# EAGLE schematic DAQ2 (EAGLE 7.6.0)
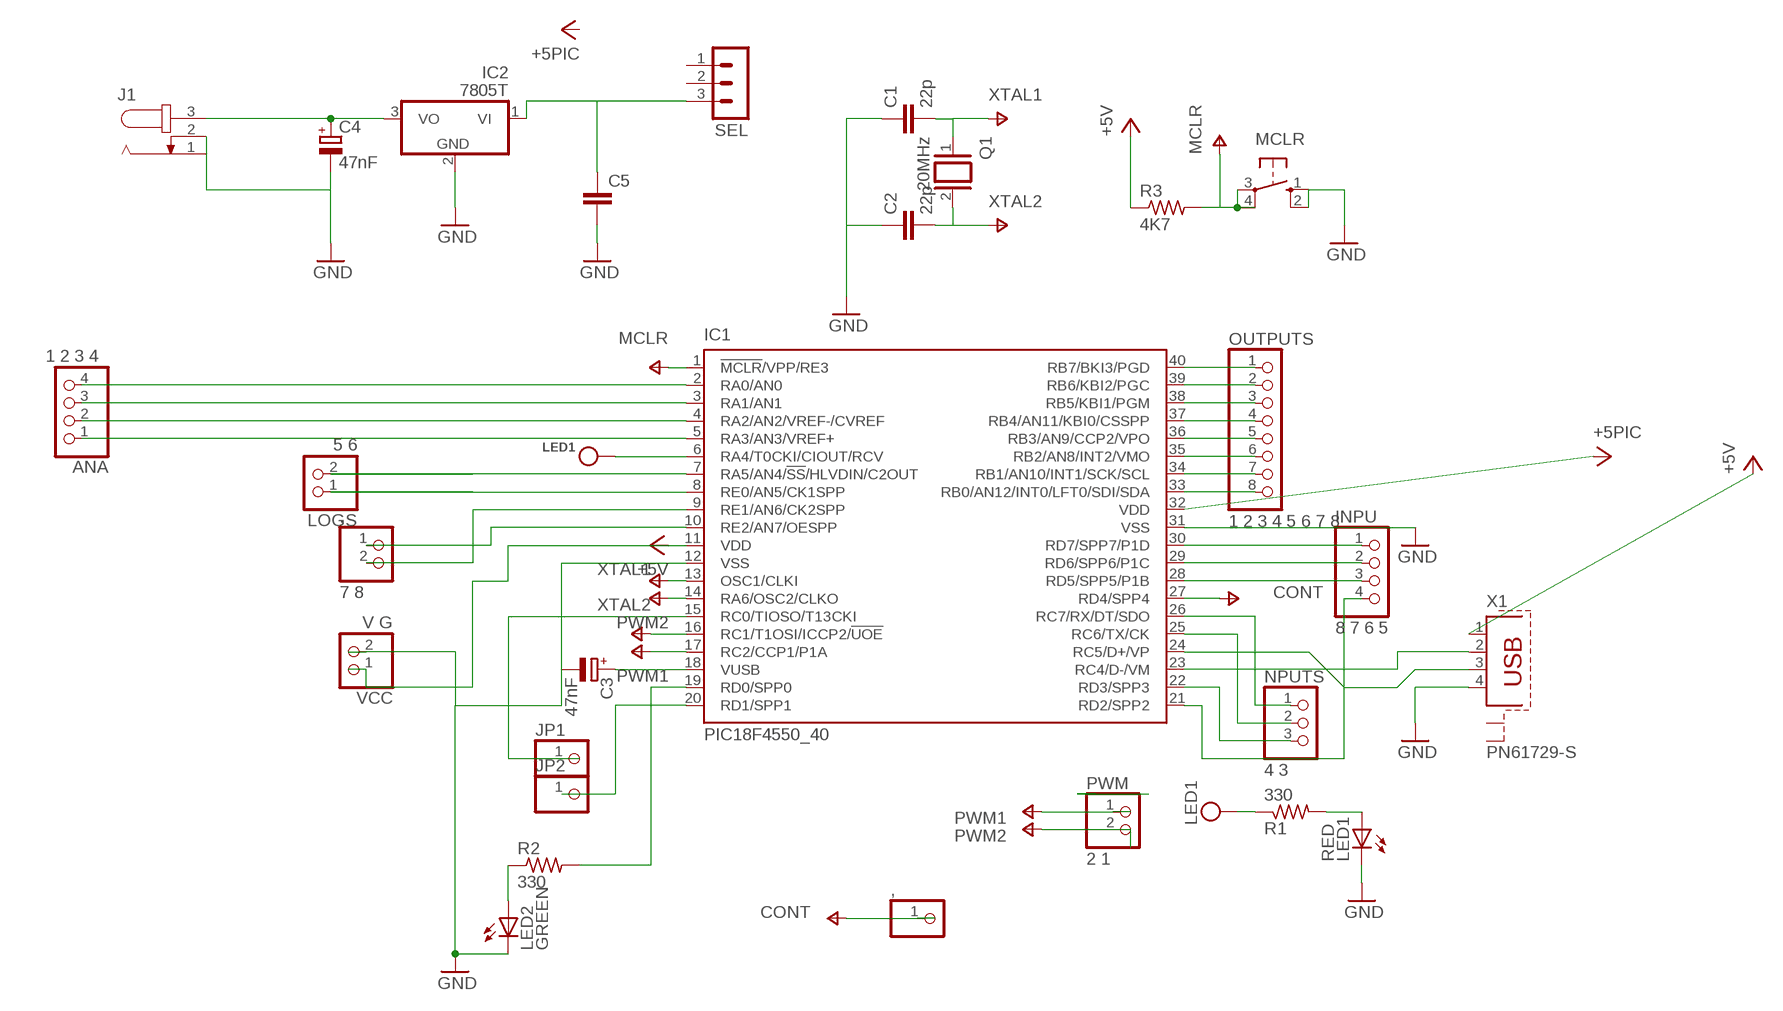
[diagram p0: schematic, sheet 1]

## Parts
,  PINHD-1X1  [1X01]
.  7 8  PINHD-1X2  [1X02]
ANA  1 2 3 4  PINHD-1X4  [1X04]
C1  22p  C-EU025-024X044  [C025-024X044]
C2  22p  C-EU025-024X044  [C025-024X044]
C3  47nF  CPOL-EUE2,5-6E  [E2,5-6E]
C4  47nF  CPOL-EUE2,5-6E  [E2,5-6E]
C5  C-EU050-035X075  [C050-035X075]
IC1  PIC18F4550_40  [DIL40]
IC2  7805T  [TO220H]
INPU  8 7 6 5  PINHD-1X4  [1X04]
J1  JACK-PLUG0  [SPC4077]
JP1  PINHD-1X1  [1X01]
JP2  PINHD-1X1  [1X01]
LED1  RED  TLLR4400  [LED3MM]
LED2  GREEN  TLLG4400  [LED3MM]
LOGS  5 6  PINHD-1X2  [1X02]
MCLR  10-XX  [B3F-10XX]
NPUTS  4 3  PINHD-1X3  [1X03]
OUTPUTS  1 2 3 4 5 6 7 8  PINHD-1X8  [1X08]
PWM  2 1  PINHD-1X2  [1X02]
Q1  20MHz  XTAL/S  [QS]
R1  330  R-US_0207/10  [0207/10]
R2  330  R-US_0207/10  [0207/10]
R3  4K7  R-US_0207/10  [0207/10]
SEL  MA03-1  [MA03-1]
VCC  V G  PINHD-1X2  [1X02]
X1  PN61729-S  [PN61729-S]

## Nets
+5PIC: IC1.11(VDD) IC1.32(VDD) R3.1 VCC.1 ; supply symbol labelled +5V
+5USB: X1.1 ; supply symbol labelled +5V
GND: C1.1 C2.1 C3.- C4.- C5.2 IC1.12(VSS) IC1.31(VSS) IC2.2(GND) J1.1 J1.2 LED1.K(C) LED2.K(C) MCLR.1(S) MCLR.2(S1) VCC.2 X1.4
MCLR: IC1.1(!MCLR!/VPP/RE3) MCLR.3(P) MCLR.4(P1) R3.2
N$1: IC1.23(RC4/D-/VM) X1.2
N$2: IC1.30(RD7/SPP7/P1D) INPU.1
N$3: IC1.40(RB7/BKI3/PGD) OUTPUTS.1
N$5: LED2.A R2.1
N$6: IC1.25(RC6/TX/CK) NPUTS.2
N$7: LED1.A R1.2
N$8: IC1.39(RB6/KBI2/PGC) OUTPUTS.2
N$9: IC1.38(RB5/KBI1/PGM) OUTPUTS.3
N$10: IC1.37(RB4/AN11/KBI0/CSSPP) OUTPUTS.4
N$11: IC1.36(RB3/AN9/CCP2/VPO) OUTPUTS.5
N$12: IC1.35(RB2/AN8/INT2/VMO) OUTPUTS.6
N$13: IC1.34(RB1/AN10/INT1/SCK/SCL) OUTPUTS.7
N$14: IC1.33(RB0/AN12/INT0/LFT0/SDI/SDA) OUTPUTS.8
N$15: IC1.24(RC5/D+/VP) X1.3
N$16: IC1.29(RD6/SPP6/P1C) INPU.2
N$17: IC1.28(RD5/SPP5/P1B) INPU.3
N$18: IC1.22(RD3/SPP3) NPUTS.3
N$19: IC1.15(RC0/TIOSO/T13CKI) JP1.1
N$20: C3.+ IC1.18(VUSB)
N$21: IC1.21(RD2/SPP2) INPU.4
N$22: IC1.19(RD0/SPP0) R2.2
N$23: ANA.4 IC1.2(RA0/AN0)
N$24: ANA.3 IC1.3(RA1/AN1)
N$25: ANA.2 IC1.4(RA2/AN2/VREF-/CVREF)
N$26: ANA.1 IC1.5(RA3/AN3/VREF+)
N$27: IC1.7(RA5/AN4/!SS!/HLVDIN/C2OUT) LOGS.2
N$28: IC1.8(RE0/AN5/CK1SPP) LOGS.1
N$29: IC1.20(RD1/SPP1) JP2.1
N$31: ..2 IC1.9(RE1/AN6/CK2SPP)
N$32: ..1 IC1.10(RE2/AN7/OESPP)
N$131: C4.+ IC2.3(VO) J1.3
N$132: C5.1 IC2.1(VI) SEL.3
N$137: IC1.26(RC7/RX/DT/SDO) NPUTS.1
PWM1: IC1.17(RC2/CCP1/P1A) PWM.1
PWM2: IC1.16(RC1/T1OSI/ICCP2/!UOE) PWM.2
V+: ,.1 IC1.27(RD4/SPP4) ; supply symbol labelled CONT
VCC: IC1.6(RA4/T0CKI/CIOUT/RCV) R1.1 ; supply symbol labelled LED1
XTAL1: C1.2 IC1.13(OSC1/CLKI) Q1.1
XTAL2: C2.2 IC1.14(RA6/OSC2/CLKO) Q1.2
Unconnected: SEL.1 SEL.2 X1.S1 X1.S2

## Library data of the parts
, JP1 JP2 = pinhead:PINHD-1X1: PIN HEADER
. LOGS PWM VCC = pinhead:PINHD-1X2: PIN HEADER
ANA INPU = pinhead:PINHD-1X4: PIN HEADER
C1 C2 C5 = rcl:C-EU: CAPACITOR, European symbol
C3 C4 = resistor:CPOL-EU: POLARIZED CAPACITOR, European symbol
IC1 = microchip:PIC18F4*_40: USB Microcontrollers with nanoWatt Technology High-Performance, Enhanced Flash, 28/40/44-Pin, Source: http://ww1.microchip.com/downloads/en/devicedoc/39632c.pdf; MF: MICROCHIP; MPN: PIC18F4550-I/P; OC_FARNELL: 9321357; OC_NEWARK: 74K8623
IC2 = linear:78*: Positive VOLTAGE REGULATOR Source: http://cache.national.com/ds/LM/LM78L05.pdf http://www.fairchildsemi.com/ds/LM/LM7805.pdf
J1 = con-jack:JACK-PLUG: DC POWER JACK Power Jack, DC, Right Angle, Through Hole, Rated 5A at 16VDC, PC Terminals Distributor: Farnell (www.Farnell.de) Drawing: 84N1161.pdf / 84N1162.pdf Manufacturer: SPC Technology (www.spctechnology.com) Type: SPC4077 / SPC 4078; OC_FARNELL: unknown; OC_NEWARK: unknown
LED1 = led:TLLR4400: Low Current (2mA) LED 3 mm Tinted Diffused Package color RED Source: Data sheet <http://www.farnell.com/datasheets/391100.pdf>; MF: VISHAY SEMICONDUCTOR; OC_FARNELL: 1612437
LED2 = led:TLLG4400: Low Current (2mA) LED 3 mm Tinted Diffused Package color GREEN Source: Data sheet <http://www.farnell.com/datasheets/391098.pdf>; MF: VISHAY SEMICONDUCTOR; OC_FARNELL: 1612435
MCLR = switch-omron:10-XX: OMRON SWITCH; MPN: B3F-1000; OC_FARNELL: 176432; OC_NEWARK: 36M3542
NPUTS = pinhead:PINHD-1X3: PIN HEADER
OUTPUTS = pinhead:PINHD-1X8: PIN HEADER
Q1 = special:XTAL/S: CRYSTAL
R1-R3 = resistor:R-US_: RESISTOR, American symbol
SEL = con-lstb:MA03-1: PIN HEADER; OC_FARNELL: unknown; OC_NEWARK: unknown
X1 = con-berg:PN61729-S: BERG USB connector; OC_FARNELL: unknown; OC_NEWARK: unknown